# Altium schematic sheet Regulators.SchDoc
size A4
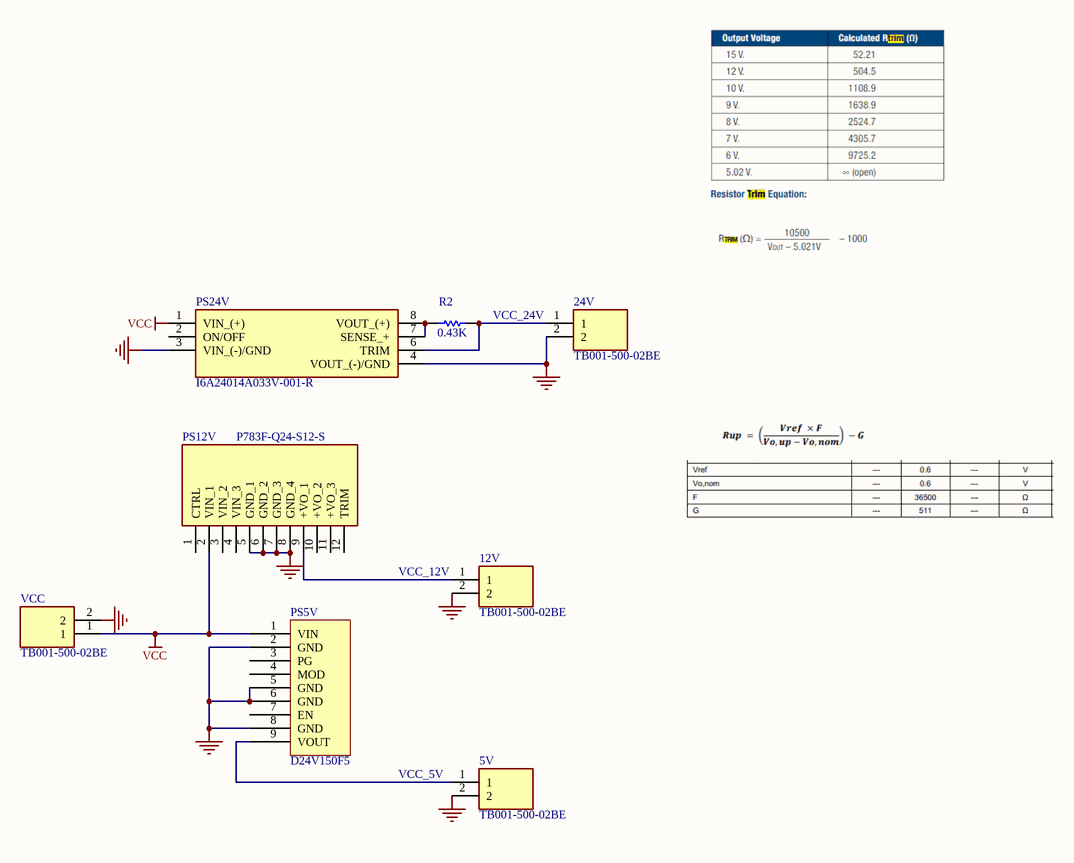
[diagram p0: Regulators.SchDoc]

## Parts
5V  TB001-500-02BE  [TB00150002BE]
12V  TB001-500-02BE  [TB00150002BE]
24V  TB001-500-02BE  [TB00150002BE]
PS5V  D24V150F5  [D24V150F5]
PS12V  P783F-Q24-S12-S  [P783FQ24S12S]
PS24V  I6A24014A033V-001-R  [I6A24014A033V001R]
R2  value 0.43K  [AXIAL-0.3]  (hidden comment: Res1)
VCC  TB001-500-02BE  [TB00150002BE]

## Nets
GND: 5V.2 12V.2 24V.2 PS5V.2(GND) PS5V.5(GND) PS5V.6(GND) PS5V.8(GND) PS12V.5(GND_1) PS12V.6(GND_2) PS12V.7(GND_3) PS12V.8(GND_4) PS24V.3(VIN_(-)/GND) PS24V.4(VOUT_(-)/GND) VCC.2
VCC: PS5V.1(VIN) PS12V.2(VIN_1) PS24V.1(VIN_(+)) VCC.1
Net5V_1: 5V.1 PS5V.9(VOUT)
Net12V_1: 12V.1 PS12V.9(+VO_1)
Net24V_1: 24V.1 PS24V.6(TRIM) R2.1
NetPS24V_7: PS24V.7(SENSE_+) PS24V.8(VOUT_(+)) R2.2

Not connected (* = marked no-connect by the designer): PS5V 3(PG) 4(MOD) 7(EN); PS12V 1(CTRL) 3(VIN_2) 4(VIN_3) 10(+VO_2) 11(+VO_3) 12(TRIM); PS24V 2(ON/OFF)

## Notes on the sheet
- VCC_24V
- (near 12V) VCC_12V
- (near 5V) VCC_5V

## Library data of the parts
5V 12V 24V VCC = TB001-500-02BE: Integrated Circuit; Manufacturer_Name: CUI Inc.; Datasheet Link: https://componentsearchengine.com//TB001-500-02BE.pdf; Height: 12.9mm; Mouser2 Part Number: 490-TB001-500-02BE; Mouser2 Price/Stock: https://www.mouser.com/Search/Refine.aspx?Keyword=490-TB001-500-02BE; Manufacturer_Part_Number: TB001-500-02BE
PS5V = D24V150F5: 5V, 15A Step-Down Voltage Regulator
PS12V = P783F-Q24-S12-S: Power Supply; Manufacturer_Name: CUI Inc.; Datasheet Link: https://www.cui.com/product/resource/p783f-s.pdf; Height: 13mm; Manufacturer_Part_Number: P783F-Q24-S12-S
PS24V = I6A24014A033V-001-R: Power Supply; Manufacturer_Name: TDK; Datasheet Link: https://componentsearchengine.com//I6A24014A033V-001-R.pdf; Height: 12.1mm; Mouser2 Part Number: 967-I6A24014A033V001; Mouser2 Price/Stock: https://www.mouser.com/Search/Refine.aspx?Keyword=967-I6A24014A033V001; Manufacturer_Part_Number: I6A24014A033V-001-R
R2 = Res1: Resistor; Published: 8-Jun-2000; LatestRevisionDate: 17-Jul-2002; LatestRevisionNote: Re-released for DXP Platform.; PackageReference: AXIAL-0.3; Publisher: Altium Limited; PackageDescription: Axial Device, Thru-Hole; 2 Leads; 0.3 in Pin Spacing